# EAGLE design kl_r3t (EAGLE 5.03)
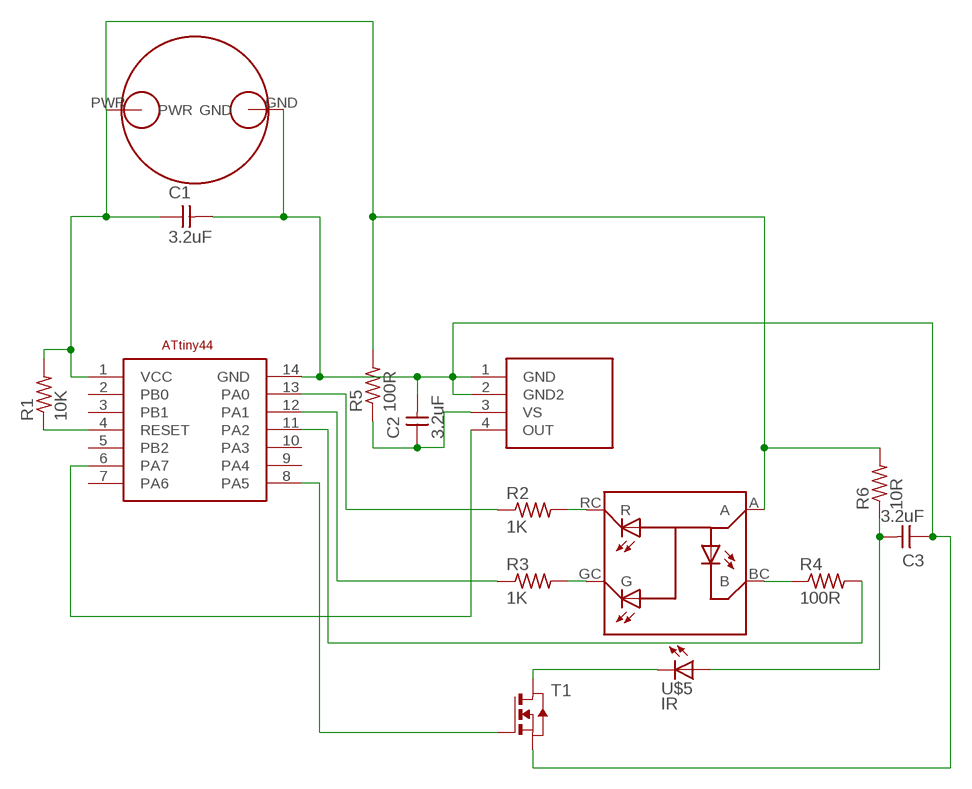
[diagram p0: schematic, sheet 1]

## Parts
C1  3.2uF  UNPOLARIZED_CAPACITOR1206  [1206]
C2  3.2uF  UNPOLARIZED_CAPACITOR1206  [1206]
C3  3.2uF  UNPOLARIZED_CAPACITOR1206  [1206]
R1  10K  RESISTOR1206  [1206]
R2  1K  RESISTOR1206  [1206]
R3  1K  RESISTOR1206  [1206]
R4  100R  RESISTOR1206  [1206]
R5  100R  RESISTOR1206  [1206]
R6  10R  RESISTOR1206  [1206]
T1  NMOSFETSOT23  [SOT-23]
U$1  ATTINY44  [SO14]
U$2  TSOP36238  [TSOP36238]
U$3  COINCELL_HOLDER_103  [COINCELL_HOLDER]
U$4  RGB_LED_LATB_T686  [LATB_T686]
U$5  IR  LED1206  [1206]

## Nets
N$1: C1.1 R1.2 R5.2 R6.2 U$1.1(VCC) U$3.PWR U$4.A
N$2: C3.2 R6.1 U$5.1(A)
N$3: T1.3(G) U$1.8(PA5)
N$4: C2.1 R5.1 U$2.3(VS)
N$5: R1.1 U$1.4(RESET)
N$6: U$1.6(PA7) U$2.4(OUT)
N$7: R2.2 U$4.RC(R)
N$8: R3.2 U$4.GC(G)
N$9: R2.1 U$1.13(PA0)
N$10: R3.1 U$1.12(PA1)
N$11: R4.1 U$4.BC(B)
N$12: R4.2 U$1.11(PA2)
N$13: T1.1(D) U$5.2(C)
N$14: C1.2 C2.2 C3.1 T1.2(S) U$1.14(GND) U$2.1(GND) U$2.2(GND2) U$3.GND
Unconnected: U$1.2(PB0) U$1.3(PB1) U$1.5(PB2) U$1.7(PA6) U$1.9(PA4) U$1.10(PA3)

## Library data of the parts
C1-C3 = ng:UNPOLARIZED_CAPACITOR: unpolarized_capacitor
R1-R6 = ng:RESISTOR
T1 = ng:NMOSFET: MOS FET
U$1 = cfd:ATTINY44
U$2 = cfd:TSOP36238
U$3 = cfd:COINCELL_HOLDER_103
U$4 = cfd:RGB_LED_LATB_T686
U$5 = ng:LED

## Board
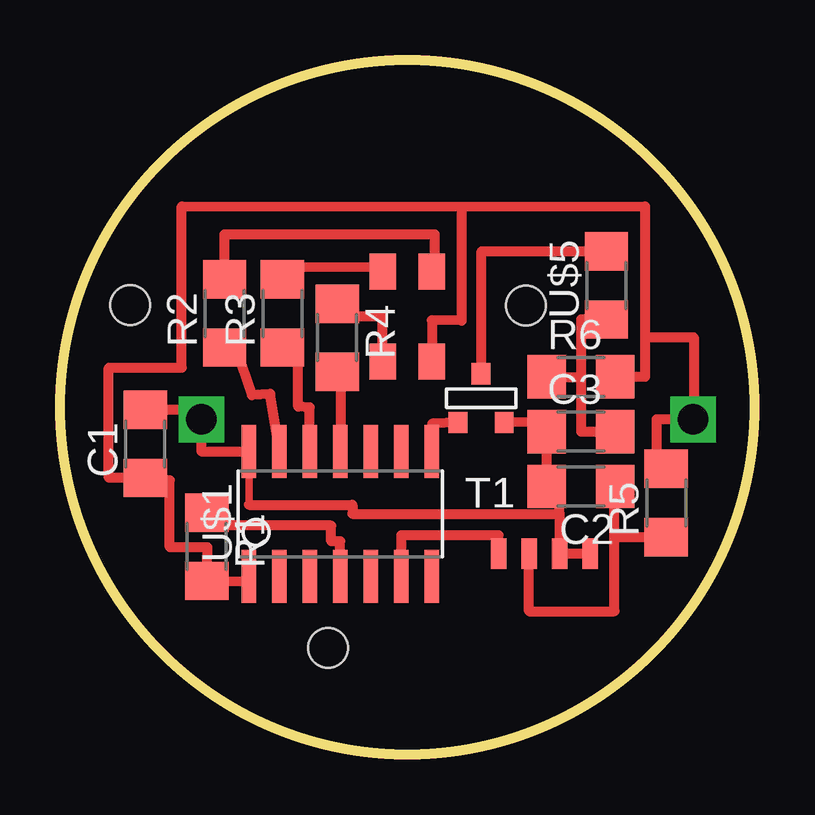
[diagram p1: board, top side]

Size 28.96 x 28.96 mm. Coordinates in mm from the lower left corner, seen from the top.
Outline: circle at 14.48,14.48 radius 14.48
Copper layers (1*16): Top 0.035mm / dielectric 1.5mm / Bottom 0.035mm
Design rules "default *": minimum track width 10mil, minimum drill 24mil, track to track 16mil, track to pad 16mil, pad to pad 16mil, via to via 16mil, smd to smd 8mil, copper to edge 40mil, drill to drill 8mil, minimum pad ring 10mil, minimum via ring 8mil, stop-mask expansion 4mil, vias tented up to drill 0mil, thermal gap 10mil

### Footprints (pad centres in the part's own frame; a part is rotated, then mirrored left to right if it is on the bottom)
1206 = smd 1.6 x 1.803: 1 -1.422,0; 2 1.422,0
SOT-23 = smd 0.787 x 0.889: 1 0.025,-1.016; 2 -0.94,1.016; 3 0.991,1.016
SO14 = smd 0.61 x 2.21: 1 -3.81,-2.603; 2 -2.54,-2.603; 3 -1.27,-2.603; 4 0,-2.603; 5 1.27,-2.603; 6 2.54,-2.603; 7 3.81,-2.603; 8 3.81,2.603; 9 2.54,2.603; 10 1.27,2.603; 11 0,2.603; 12 -1.27,2.603; 13 -2.54,2.603; 14 -3.81,2.603
TSOP36238 = smd 1.27 x 0.635: 1 0,1.27; 2 0,0; 3 0,-1.27; 4 0,-2.54
COINCELL_HOLDER = drill 1.27 square: GND -5.283,0; PWR 15.215,0 | hole 1.651: -8.255,4.775; 8.255,4.75; 0,-9.525
LATB_T686 = smd 1.1 x 1.5: A -1.025,1.875; BC 1.025,1.875; GC 1.025,-1.875; RC -1.025,-1.875

### Placement (x,y rotation side)
C1  3.56,12.96 90 top
C2  21.72,11.18 180 top
C3  21.72,13.46 0 top
R1  6.12,8.66 270 top
R2  6.86,18.39 90 top
R3  9.27,18.39 90 top
R4  11.56,17.38 270 top
R5  25.28,10.49 90 top
R6  21.72,15.75 0 top
T1  17.58,14.86 180 top
U$1  11.69,10.04 0 top
U$2  20.83,8.38 270 top
U$3  11.18,13.97 0 top
U$4  14.48,18.26 180 top
U$5  22.79,19.56 90 top

### Tracks (layer width: path | path; a pad name or v marks a point on that pad's centre or on a via)
N$1
  Top 0.406: R1.2 6.35,7.05 | U$1.1 7.88,7.22 R1.2 | R1.2 6.15,8.64 4.57,8.64 4.57,11.43 C1.1 2.03,11.53 2.03,16.13 5.08,16.13 5.08,22.86 16.74,22.84 | 24.39,17.4 24.39,22.86 16.74,22.84 | 24.39,17.4 26.42,17.4 26.42,14.48 U$3.PWR 24.87,13.97 24.87,12.09 R5.2 | R6.2 24.39,15.75 24.39,17.4 | U$4.A 15.51,18.11 16.74,18.09 16.74,22.84
N$2
  Top 0.406: C3.2 21.72,13.46 21.72,15.75 | R6.1 21.72,15.75 | U$5.1 21.72,18.14 21.72,15.75
N$3
  Top 0.406: T1.3 15.52,13.79 U$1.8
N$4
  Top 0.406: 23.12,9.07 R5.1 | U$2.3 19.56,5.97 23.12,5.97 23.12,9.07 | 23.12,9.07 23.12,11.56 C2.1
N$5
  Top 0.406: U$1.4 11.69,8.89 11.31,8.89 11.31,9.55 6.86,9.55 R1.1 6.86,10.16
N$6
  Top 0.406: U$2.4 18.29,9.15 14.23,9.15 U$1.6
N$7
  Top 0.406: R2.2 6.86,21.69 15.62,21.69 15.62,19.89 U$4.RC
N$8
  Top 0.406: U$4.GC 13.58,20.32 8.89,20.3 8.89,19.81 R3.2
N$9
  Top 0.406: U$1.13 8.77,15.04 8,14.99 7.37,16.87 7.24,16.87 R2.1
N$10
  Top 0.406: U$1.12 10.42,14.48 9.93,14.51 9.93,17 R3.1
N$11
  Top 0.406: U$4.BC 13.46,18.27 11.81,18.27 11.81,18.8 R4.1
N$12
  Top 0.406: R4.2 11.71,16.44 U$1.11
N$13
  Top 0.406: T1.1 17.58,16.13 17.58,20.98 22.28,20.98 U$5.2
N$14
  Top 0.305: U$1.14 7.88,10.42
  Top 0.406: U$1.14 5.9,12.64 U$3.GND 5.9,14.38 C1.2 | U$2.1 U$2.2 20.83,10.04 | 7.88,10.42 12.19,10.42 12.19,10.04 20.83,10.04 | 20.83,10.04 20.83,11.18 C2.2 20.3,13.87 | 20.3,13.87 C3.1 | 20.3,13.87 T1.2